# Altium schematic sheet DoorControllerv2.SchDoc
size A
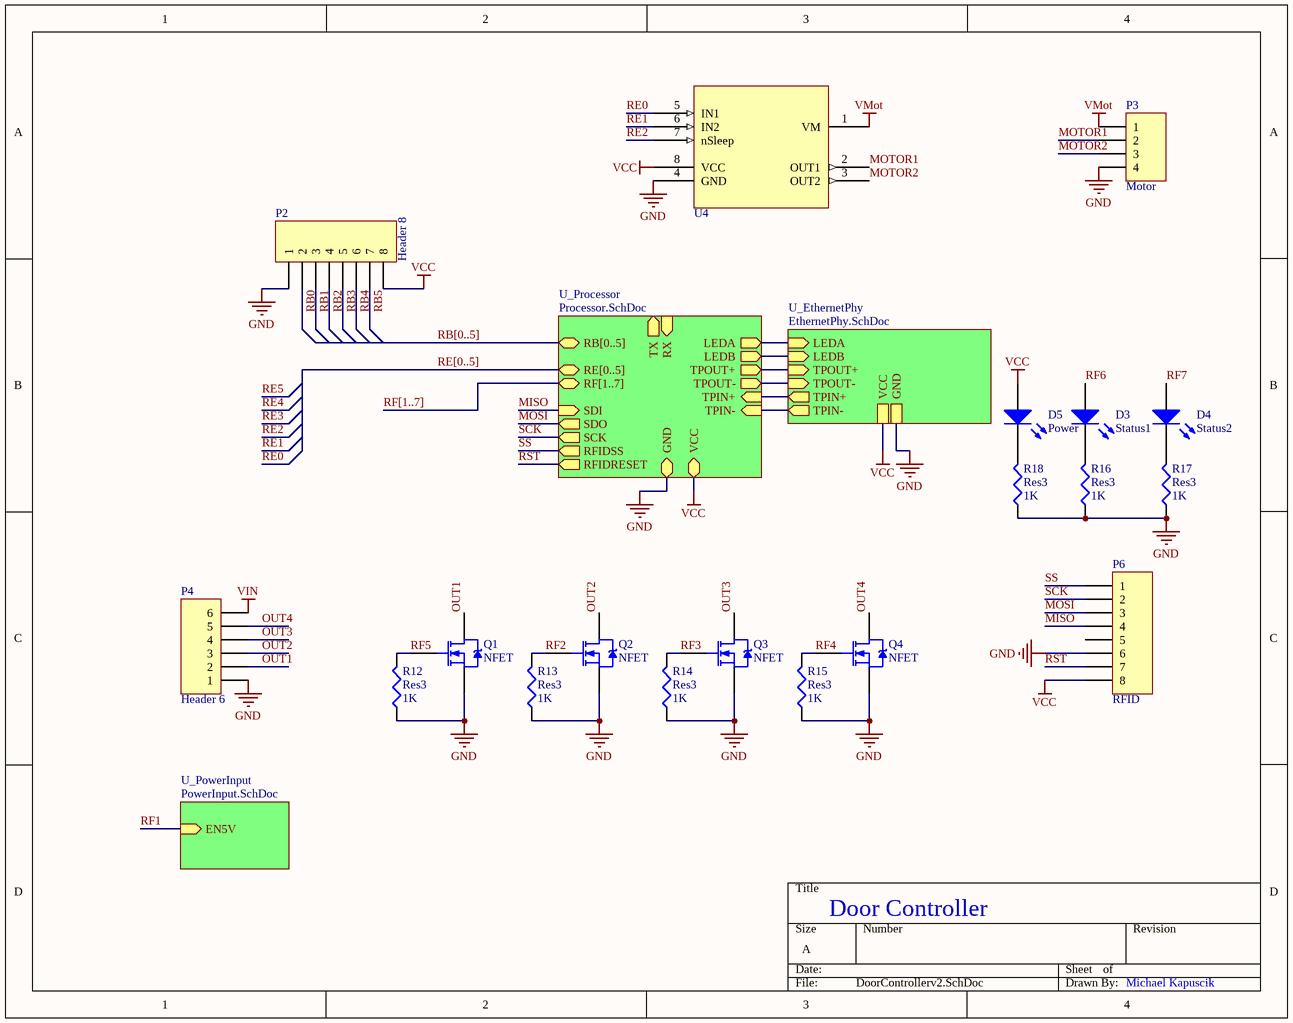
[diagram p0: DoorControllerv2.SchDoc]

## Parts
D3  Status1  [0603 LED]
D4  Status2  [0603 LED]
D5  Power  [0603 LED]
P2  Header 8  [HDR1X8]
P3  Motor  [HDR1X4]
P4  Header 6  [HDR1X6]
P6  RFID  [HDR1X8]
Q1  NFET  [SOT-23_M]
Q2  NFET  [SOT-23_M]
Q3  NFET  [SOT-23_M]
Q4  NFET  [SOT-23_M]
R12  Res3  value 1K  [J1-0603]
R13  Res3  value 1K  [J1-0603]
R14  Res3  value 1K  [J1-0603]
R15  Res3  value 1K  [J1-0603]
R16  Res3  value 1K  [J1-0603]
R17  Res3  value 1K  [J1-0603]
R18  Res3  value 1K  [J1-0603]
U4  1.8A H-Bridge  [S-PWSON-N8]  (value not drawn)

## Sub-sheets
U_EthernetPhy = EthernetPhy.SchDoc: LEDB (in), LEDA (in), TPIN+ (out), TPIN- (out), TPOUT+ (in), TPOUT- (in), VCC, GND
U_PowerInput = PowerInput.SchDoc: EN5V (in)
U_Processor = Processor.SchDoc: TPIN- (in), TPIN+ (in), TPOUT- (out), TPOUT+ (out), LEDA (out), LEDB (out), RB[0..5] (bidir), RE[0..5] (bidir), RF[1..7] (bidir), SCK (out), SDI (in), SDO (out), GND, VCC, TX (out), RX (in), RFIDSS (out), RFIDRESET (out)

## Nets
GND: P2.1 P3.4 P4.1 P6.6 Q1.2(S) Q2.2(S) Q3.2(S) Q4.2(S) R12.1 R13.1 R14.1 R15.1 R16.1 R17.1 R18.1 U4.4(GND) ; sheet U_Processor/GND, sheet U_EthernetPhy/GND
VCC: D5.1(A) P2.8 P6.8 U4.8(VCC) ; sheet U_Processor/VCC, sheet U_EthernetPhy/VCC
VIN: P4.6
VMot: P3.1 U4.1(VM)
MISO: P6.4 ; sheet U_Processor/SDI
MOSI: P6.3 ; sheet U_Processor/SDO
MOTOR1: P3.2 U4.2(OUT1)
MOTOR2: P3.3 U4.3(OUT2)
OUT1: P4.2 Q1.3(D)
OUT2: P4.3 Q2.3(D)
OUT3: P4.4 Q3.3(D)
OUT4: P4.5 Q4.3(D)
RB0: P2.2
RB1: P2.3
RB2: P2.4
RB3: P2.5
RB4: P2.6
RB5: P2.7
RE0: U4.5(IN1)
RE1: U4.6(IN2)
RE2: U4.7(nSleep)
RF1: sheet U_PowerInput/EN5V
RF2: Q2.1(G) R13.2
RF3: Q3.1(G) R14.2
RF4: Q4.1(G) R15.2
RF5: Q1.1(G) R12.2
RF6: D3.1(A)
RF7: D4.1(A)
RST: P6.7 ; sheet U_Processor/RFIDRESET
SCK: P6.2 ; sheet U_Processor/SCK
SS: P6.1 ; sheet U_Processor/RFIDSS
NetD3_2: D3.2(K) R16.2
NetD4_2: D4.2(K) R17.2
NetD5_2: D5.2(K) R18.2
(unnamed): sheet U_Processor/TPIN-, sheet U_EthernetPhy/TPIN-
(unnamed): sheet U_Processor/TPIN+, sheet U_EthernetPhy/TPIN+
(unnamed): sheet U_Processor/TPOUT-, sheet U_EthernetPhy/TPOUT-
(unnamed): sheet U_Processor/TPOUT+, sheet U_EthernetPhy/TPOUT+
(unnamed): sheet U_Processor/LEDA, sheet U_EthernetPhy/LEDA
(unnamed): sheet U_Processor/LEDB, sheet U_EthernetPhy/LEDB

Not connected (* = marked no-connect by the designer): P6 5

## Buses and harness runs
bus RB[0..5] = sheet U_Processor/RB[0..5]
bus RE[0..5] = sheet U_Processor/RE[0..5]
bus RF[1..7] = sheet U_Processor/RF[1..7]

## Notes on the sheet
- Door Controller
- Michael Kapuscik

## Library data of the parts
D3-D5 = LED0: Typical INFRARED GaAs LED; Published: 8-Jun-2000; LatestRevisionDate: 08-Jul-2005; LatestRevisionNote: Mech Layer 1 removed.; PackageReference: LED-0; Publisher: Altium Limited; PackageDescription: LED; 2 Leads
P2 P6 = Header 8: Header, 8-Pin; LatestRevisionDate: 17-Jul-2002; LatestRevisionNote: Re-released for DXP Platform.; Publisher: Altium Limited
P3 = Header 4: Header, 4-Pin; LatestRevisionDate: 17-Jul-2002; LatestRevisionNote: Re-released for DXP Platform.; Publisher: Altium Limited
P4 = Header 6: Header, 6-Pin; LatestRevisionDate: 17-Jul-2002; LatestRevisionNote: Re-released for DXP Platform.; Publisher: Altium Limited
Q1-Q4 = AO3418: 30V 3.4A N channel HEXFET
R12-R18 = Res3: Resistor; Published: 8-Jun-2000; LatestRevisionDate: 29-May-2009; LatestRevisionNote: IPC-7351 Footprint Added.; PackageReference: J1-0603; Publisher: Altium Limited; PackageDescription: Chip Resistor
U4 = DRV8837 H-Bridge: 1.8A H0bridge with integrated motor drive FETs; Supplier 1: Digi-Key; Supplier Part Number 1: 296-34806-1-ND